# Altium schematic sheet AVOUT_JACK.SchDoc
size A3
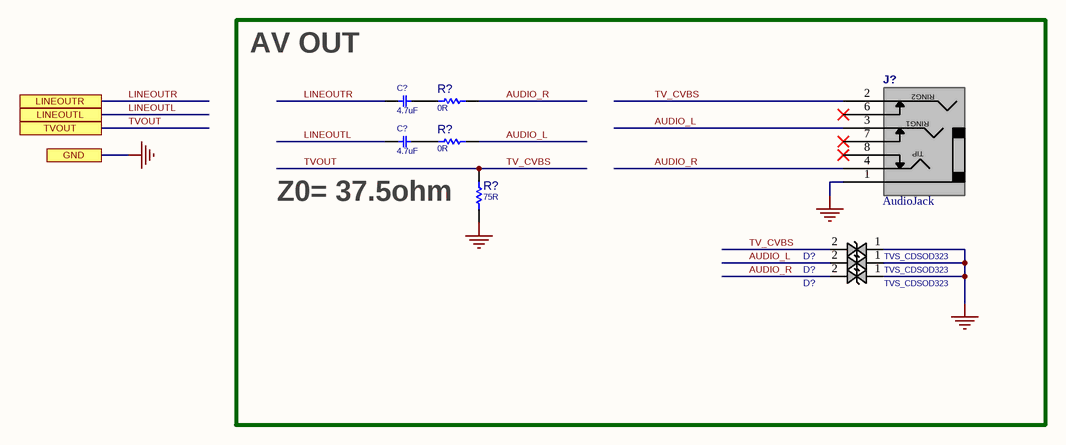
[diagram p0: AVOUT_JACK.SchDoc]

## Parts
(Parts that share a designator on the sheet are numbered #1, #2 ... from top to bottom, then left to right.)
C?#1  4.7uF  [C0402]
C?#2  4.7uF  [C0402]
D?#1  TVS_CDSOD323  [D0805]
D?#2  TVS_CDSOD323  [D0805]
D?#3  TVS_CDSOD323  [D0805]
J?  AudioJack  [JCKAS_PJ340]
R?#1  0R  [R0402]
R?#2  0R  [R0402]
R?#3  75R  [R0402]

## Ports
GND, LINEOUTL, LINEOUTR, TVOUT

## Nets
GND: D?#1.1 D?#2.1 D?#3.1 J?.1(SLEEVE) R?#3.1 ; port GND
AUDIO_L: D?#2.2 J?.3(RING1) R?#2.1
AUDIO_R: D?#3.2 J?.4(TIP) R?#1.1
LINEOUTL: C?#2.1 ; port LINEOUTL
LINEOUTR: C?#1.1 ; port LINEOUTR
TV_CVBS: D?#1.2 J?.2(RING2) R?#3.2 ; port TVOUT  [also labelled TVOUT]
NetC?#1_2: C?#1.2 R?#1.2
NetC?#2_2: C?#2.2 R?#2.2

Not connected (* = marked no-connect by the designer): J? 6(RING2SW)* 7(RING1SW)* 8(TIPSW)*

## Notes on the sheet
- AV OUT
- Z0= 37.5ohm

## Library data of the parts
C?#1 C?#2 = CAP_SMD_MLCC_100n50TDK: CAP, MLCC; PARAM: X5R, 20%; MANF_P#: LMK105BBJ475MVLF; MANF: Taiyo Yuden; PARAM2: 10v; ASSEMBLY: ASSEMBLY; PRICE: 10,000: $0.034; VALUE: 4.7uF
D?#1-D?#3 = TVS_CDSOD323: TVS, ESD PROTECT, Bidirectional; MANF_P#: CDSOD323-T12C; MANF: Bourns; PARAM2: 13.3VB, 12VR; PRICE: 0.7$; VALUE: TVS_CDSOD323
J? = JACKA3.5SMD_PJ-340-SMD: Jack, Audio, Stereo, 3.5mm, RA, THD; MANF: xyfwcn; MANF_P#: PJ-340-SMD; PRICE: 0.5$; VALUE: AudioJack
R?#1-R?#3 = RES_SMD: RESISTOR, SMD; PARAM: 0.063W; DESC: DESCRIPTION; DIST#: MOUSER; PARAM2: 1%; MANF_P#: -; MANF: -; ASSEMBLY: ASSEMBLY; PRICE: 100= 0.3$
  R?#1 R?#2: VALUE: 0R
  R?#3: VALUE: 75R